# EAGLE design heater (EAGLE 5.10)
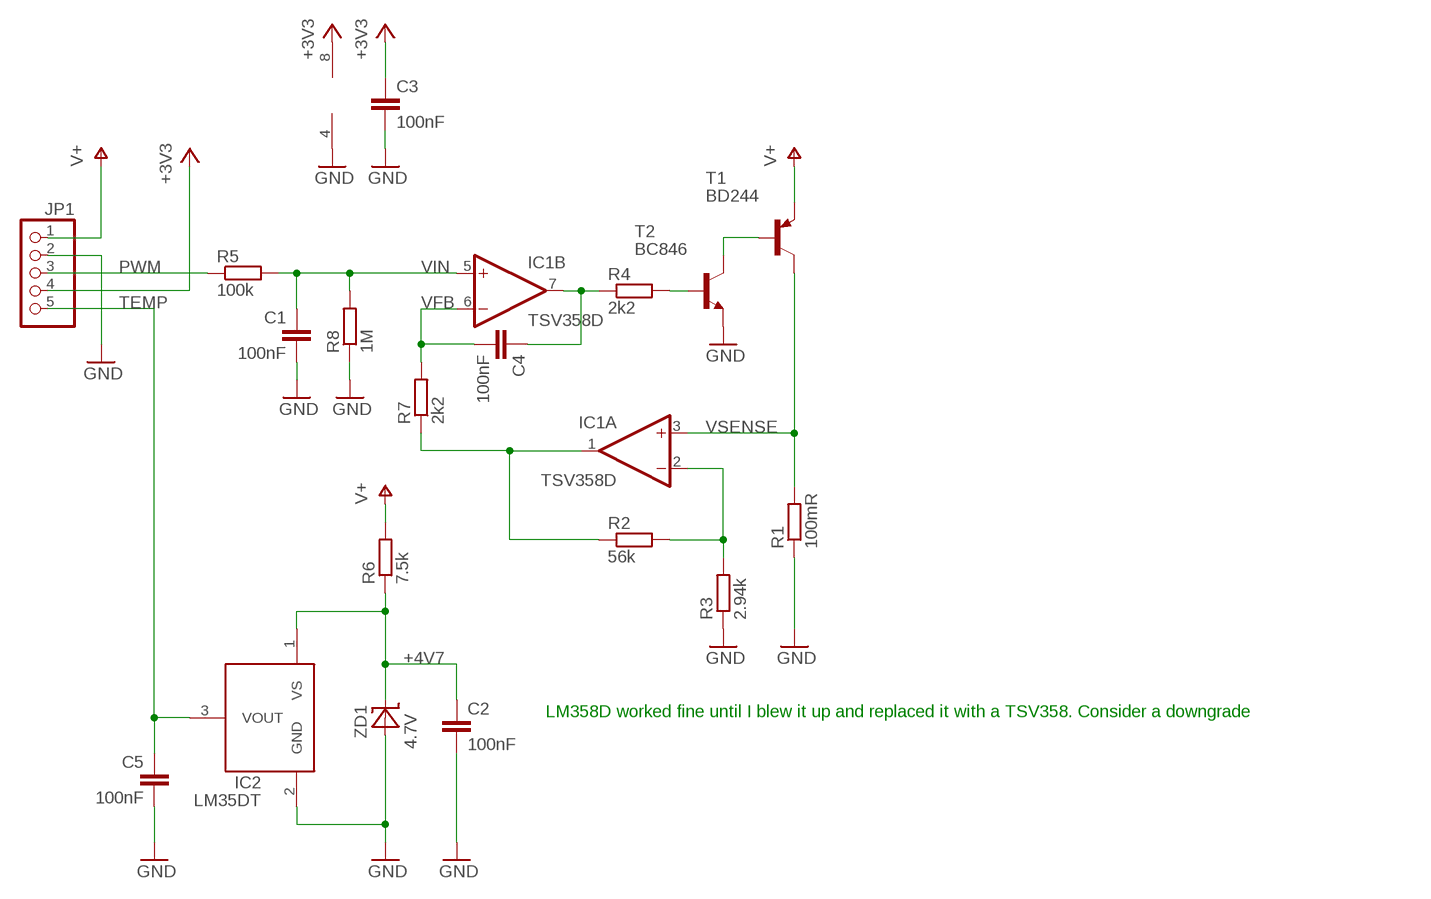
[diagram p0: schematic, sheet 1]

## Parts
C1  100nF  C-EUC0603  [C0603]
C2  100nF  C-EUC0603  [C0603]
C3  100nF  C-EUC0603  [C0603]
C4  100nF  C-EUC0603  [C0603]
C5  100nF  C-EUC0603  [C0603]
IC1  TSV358D  LM358D  [SO08]
IC2  LM35DT  [TO220]
JP1  PINHD-1X5  [1X05]
R1  100mR  R-EU_R0805  [R0805]
R2  56k  R-EU_R0603  [R0603]
R3  2.94k  R-EU_R0603  [R0603]
R4  2k2  R-EU_R0603  [R0603]
R5  100k  R-EU_R0603  [R0603]
R6  7.5k  R-EU_R1206  [R1206]
R7  2k2  R-EU_R0603  [R0603]
R8  1M  R-EU_R0603  [R0603]
T1  BD244  [TO220]
T2  BC846  [SOT23]
ZD1  4.7V  PDZ-B  [SOD323]

## Nets
+3V3: C3.1 IC1.8(P:V+) JP1.4
+4V7: C2.1 IC2.1(VS) R6.1 ZD1.1(C1)
GND: C1.2 C2.2 C3.2 C5.2 IC1.4(P:V-) IC2.2(GND) JP1.2 R1.1 R3.1 R8.1 T2.2(E) ZD1.2(A1)
N$1: T1.1(B) T2.3(C)
N$2: R4.2 T2.1(B)
N$3: C4.1 IC1.7(B:OUT) R4.1
N$6: IC1.2(A:-IN) R2.2 R3.2
PWM: JP1.3 R5.1
TEMP: C5.1 IC2.3(VOUT) JP1.5
V+: JP1.1 R6.2 T1.3(E)
VFB: C4.2 IC1.6(B:-IN) R7.2
VIN: C1.1 IC1.5(B:+IN) R5.2 R8.2
VSENSE: IC1.3(A:+IN) R1.2 T1.2(C)
VSENSEAMP: IC1.1(A:OUT) R2.1 R7.1

## Notes on the sheet
- LM358D worked fine until I blew it up and replaced it with a TSV358. Consider a downgrade

## Library data of the parts
C1-C5 = rcl:C-EU: CAPACITOR, European symbol
IC1 = linear:LM358: OP AMP also LM158; LM258; LM2904 Source: http://cache.national.com/ds/LM/LM158.pdf
IC2 = heater:LM35
JP1 = pinhead:PINHD-1X5: PIN HEADER
R1-R8 = rcl:R-EU_: RESISTOR, European symbol
T1 = transistor:BD244: PNP TRANSISTOR Source: Motorola Semiconductor, Master Selection Guide Q3/95 SG73 REV 8 page 5.5-5
T2 = transistor:BC846: NPN TRANSISTOR
ZD1 = heater:PDZ-B

## Board
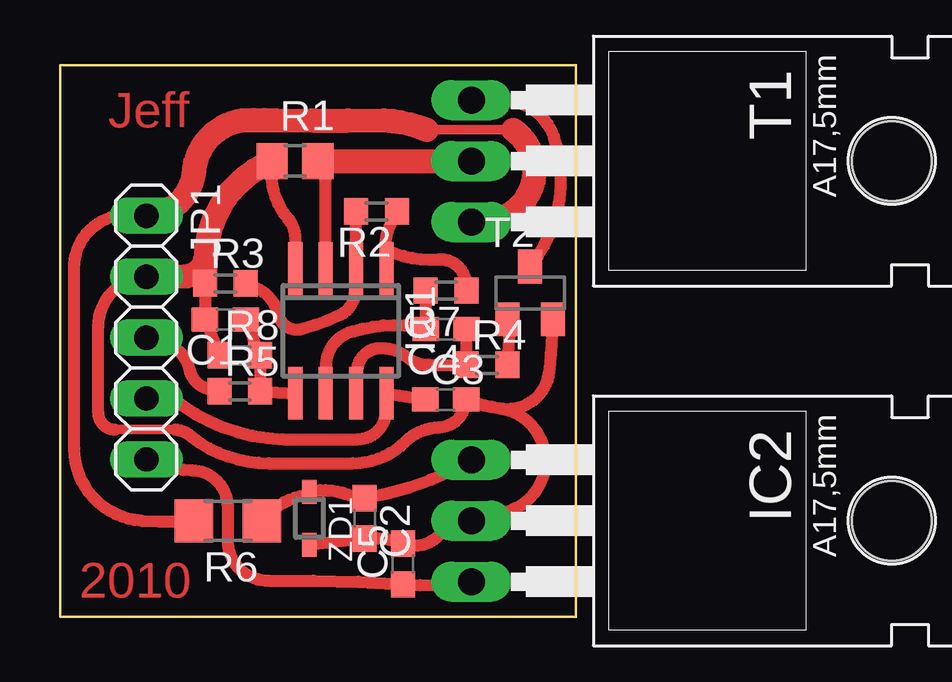
[diagram p1: board, top side]

Size 21.5 x 23 mm. Coordinates in mm from the lower left corner, seen from the top.
Outline: 0,23 21.5,23 21.5,0 0,0 0,23
Copper layers (1*16): Top 0.035mm / dielectric 1.5mm / Bottom 0.035mm
Design rules "default": minimum track width 10mil, minimum drill 24mil, track to track 8mil, track to pad 8mil, pad to pad 8mil, via to via 8mil, smd to smd 8mil, copper to edge 40mil, drill to drill 8mil, minimum pad ring 10mil, minimum via ring 8mil, stop-mask expansion 4mil, vias tented up to drill 0mil, thermal gap 10mil

### Footprints (pad centres in the part's own frame; a part is rotated, then mirrored left to right if it is on the bottom)
C0603 = smd 1.1 x 1: 1 -0.85,0; 2 0.85,0
SO08 = smd 0.6 x 2.2: 1 -1.905,-2.6; 2 -0.635,-2.6; 3 0.635,-2.6; 4 1.905,-2.6; 5 1.905,2.6; 6 0.635,2.6; 7 -0.635,2.6; 8 -1.905,2.6
TO220 = drill 1.118 long: 1 -2.54,-6.35; 2 0,-6.35; 3 2.54,-6.35 | hole 3.302: 0,11.176
1X05 = drill 1.016 long: 1 -5.08,0; 2 -2.54,0; 3 0,0; 4 2.54,0; 5 5.08,0
R0805 = smd 1.3 x 1.5: 1 -0.95,0; 2 0.95,0
R0603 = smd 1 x 1.1: 1 -0.85,0; 2 0.85,0
R1206 = smd 1.6 x 1.803: 1 -1.422,0; 2 1.422,0
SOT23 = smd 1 x 1.4: 1 -0.95,-1.1; 2 0.95,-1.1; 3 0,1.1
SOD323 = smd 1 x 0.6: 1 -1.1,0; 2 1.1,0

### Placement (x,y rotation side)
C1  6.9,12.4 180 top
C2  12.7,4.1 270 top
C3  16.08,9.05 0 top
C4  16.1,12 180 top
C5  14.3,2.2 90 top
IC1  11.71,11.92 180 top
IC2  23.5,4 270 top
JP1  3.6,11.64 270 top
R1  9.8,19 0 top
R2  13.2,16.9 180 top
R3  6.9,13.9 0 top
R4  17.8,10.5 0 top
R5  7.5,9.4 0 top
R6  7,4 180 top
R7  16.1,13.6 180 top
R8  7.5,10.9 0 top
T1  23.5,19 270 top
T2  19.6,13.5 0 top
ZD1  10.4,4.1 270 top

### Tracks (layer width: path | path; a pad name or v marks a point on that pad's centre or on a via)
+3V3
  Top 0.5: JP1.4 3.9,9.1 arc-29 4.6,9.2 arc38 9.3,7.4 12.4,7.4 arc90 13.6,8.6 arc-2 IC1.8 C3.1
+4V7
  Top 0.5: R6.1 arc-49 10.5,5.1 ZD1.1 arc-34 12,5.1 arc28 C2.1 arc21 IC2.1
GND
  Top 0.4: 2.3,7.8 4.8,7.8
  Top 0.5: IC2.2 arc15 18.5,4.3 | IC1.4 arc9 9.8,15.9 arc34 9.5,16.6 arc-50 R1.1 | JP1.2 arc87 1.6,12.1 1.6,8.5 arc90 2.3,7.8 | 4.8,7.8 arc-39 5.5,7.5 arc39 8.7,6.4 12.2,6.4 arc44 14.4,7.3 arc-43 15.8,7.9 arc87 C3.2 17.4,8.9 arc10 18.3,8.7 | 18.3,8.7 arc-168 18.2,4.3 arc22 IC2.2 | T2.2 20.5,11.3 arc-3 20.4,10.2 arc-95 18.3,8.7 | ZD1.2 C2.2 arc-25 C5.2 arc85 16,3.7 arc-102 IC2.2 | R8.1 C1.2 R3.1 arc-136 6.3,14 6.3,14.9 6.1,15.1
  Top 1: JP1.2 5.2,14.2 arc89 6.1,15.1 arc-65 R1.1
N$1
  Top 0.5: T1.1 arc9 18.4,21.5 arc-74 20.6,20 arc-58 T2.3
N$2
  Top 0.5: R4.2 18.75,11.8 arc90 T2.1
N$3
  Top 0.5: IC1.7 12.4,10.3 arc-84 13.3,11.2 arc-43 14.5,10.8 arc43 15.4,10.5 R4.1 C4.1
N$6
  Top 0.5: R2.2 IC1.2 arc-14 12.3,13.5 arc-61 11.7,12.6 arc-10 10.1,12 arc-93 9.1,12.6 arc53 8.2,13.7 R3.2
PWM
  Top 0.5: 4.2,11.6 arc0 JP1.3 arc50 3.9,11.5 arc-78 5.4,10.3 arc65 6.2,9.5 R5.1
TEMP
  Top 0.5: IC2.3 arc-13 C5.1 arc5 8.7,1.5 arc-92 7,3.2 arc2 7,4.6 arc88 5.5,6.1 arc-25 JP1.5
V+
  Top 0.4: 15.6,20.3 18.9,20.3
  Top 0.5: JP1.1 2.3,16.7 arc74 0.6,14.7 0.6,7 arc86 3.4,4 arc8 R6.2 | 15.3,20.3 arc15 15.6,20.3
  Top 1: 15.3,20.3 arc20 13.5,20.7 arc-1 9,20.7 arc4 7.6,20.7 arc76 5.6,18.6 arc-26 5.3,17.7 arc-58 JP1.1 | T1.3 17.8,16.5 arc141 18.9,20.3
VFB
  Top 0.5: IC1.6 11.1,10.5 arc-74 12.2,11.9 12.6,12 arc-28 C4.2 R7.2
VIN
  Top 0.5: C1.1 R8.2 R5.2 IC1.5
VSENSE
  Top 0.5: IC1.3 11.07,18.77 arc-90 11.3,19
  Top 1: R1.2 11.3,19 T1.2
VSENSEAMP
  Top 0.5: IC1.1 arc13 13.6,15.3 | 13.6,15.3 arc-36 13.8,16.4 arc3 R2.1 | R7.1 16.9,14 arc87 15.8,14.9 arc-29 13.6,15.3

### Text on the board
Top: Jeff | 2010